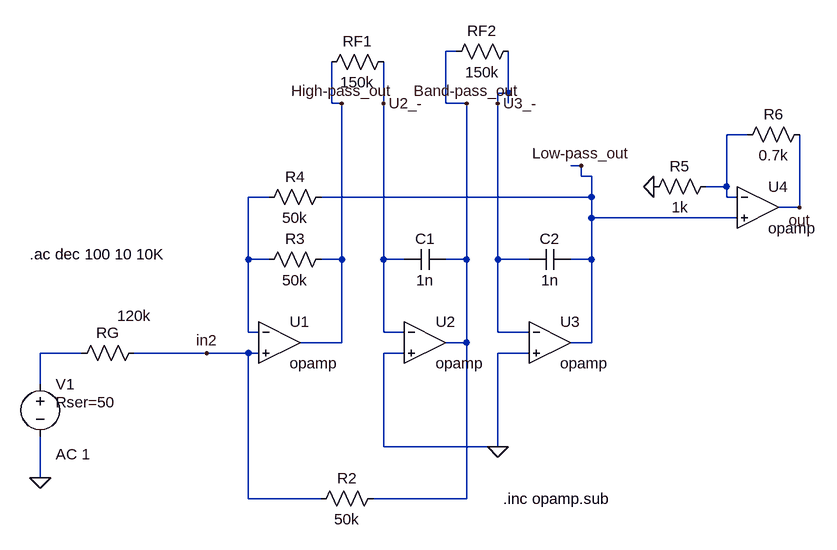
[diagram p0: schematic Desnormalizada.asc]
Desnormalizada.asc, the LTspice schematic file:
Version 4
SHEET 1 1836 1000
WIRE 896 -176 880 -176
WIRE 976 -112 976 -176
WIRE 976 -112 960 -112
WIRE 704 -96 704 -160
WIRE 720 -96 704 -96
WIRE 784 -96 784 -160
WIRE 880 -96 880 -176
WIRE 912 -96 880 -96
WIRE 960 -96 960 -112
WIRE 976 -96 976 -112
WIRE 1344 -48 1312 -48
WIRE 1088 0 1072 0
WIRE 1088 16 1088 0
WIRE 1104 16 1088 16
WIRE 1312 32 1312 -48
WIRE 1312 32 1280 32
WIRE 608 48 576 48
WIRE 1104 48 1104 16
WIRE 1104 48 688 48
WIRE 1312 48 1312 32
WIRE 1328 48 1312 48
WIRE 1424 64 1424 -48
WIRE 1424 64 1392 64
WIRE 1104 80 1104 48
WIRE 1328 80 1104 80
WIRE 576 144 576 48
WIRE 608 144 576 144
WIRE 720 144 720 -96
WIRE 720 144 688 144
WIRE 784 144 784 -96
WIRE 816 144 784 144
WIRE 912 144 912 -96
WIRE 912 144 880 144
WIRE 960 144 960 -96
WIRE 1008 144 960 144
WIRE 1104 144 1104 80
WIRE 1104 144 1072 144
WIRE 576 256 576 144
WIRE 592 256 576 256
WIRE 784 256 784 144
WIRE 816 256 784 256
WIRE 960 256 960 144
WIRE 1008 256 960 256
WIRE 720 272 720 144
WIRE 720 272 656 272
WIRE 912 272 912 144
WIRE 912 272 880 272
WIRE 1104 272 1104 144
WIRE 1104 272 1072 272
WIRE 320 288 256 288
WIRE 512 288 400 288
WIRE 576 288 512 288
WIRE 592 288 576 288
WIRE 816 288 784 288
WIRE 1008 288 960 288
WIRE 256 336 256 288
WIRE 784 432 784 288
WIRE 960 432 960 288
WIRE 960 432 784 432
WIRE 256 480 256 416
WIRE 576 512 576 288
WIRE 688 512 576 512
WIRE 912 512 912 272
WIRE 912 512 768 512
FLAG 512 288 in2
FLAG 960 432 0
FLAG 1088 0 Low-pass_out
FLAG 912 -96 Band-pass_out
FLAG 720 -96 High-pass_out
FLAG 784 -96 U2_-
FLAG 960 -96 U3_-
FLAG 256 480 0
FLAG 1200 32 0
FLAG 1424 64 out
SYMBOL voltage 256 320 R0
WINDOW 123 24 124 Left 2
WINDOW 39 24 44 Left 2
SYMATTR Value2 AC 1
SYMATTR SpiceLine Rser=50
SYMATTR InstName V1
SYMATTR Value ""
SYMBOL res 304 304 R270
WINDOW 0 32 56 VTop 2
WINDOW 3 89 97 VBottom 2
SYMATTR InstName RG
SYMATTR Value 120k
SYMBOL res 672 528 R270
WINDOW 0 32 56 VTop 2
WINDOW 3 0 56 VBottom 2
SYMATTR InstName R2
SYMATTR Value 50k
SYMBOL res 592 160 R270
WINDOW 0 32 56 VTop 2
WINDOW 3 0 56 VBottom 2
SYMATTR InstName R3
SYMATTR Value 50k
SYMBOL res 592 64 R270
WINDOW 0 32 56 VTop 2
WINDOW 3 0 56 VBottom 2
SYMATTR InstName R4
SYMATTR Value 50k
SYMBOL cap 816 160 R270
WINDOW 0 32 32 VTop 2
WINDOW 3 0 32 VBottom 2
SYMATTR InstName C1
SYMATTR Value 1n
SYMBOL cap 1008 160 R270
WINDOW 0 32 32 VTop 2
WINDOW 3 0 32 VBottom 2
SYMATTR InstName C2
SYMATTR Value 1n
SYMBOL res 688 -144 R270
WINDOW 0 32 56 VTop 2
WINDOW 3 0 56 VBottom 2
SYMATTR InstName RF1
SYMATTR Value 150k
SYMBOL res 880 -160 R270
WINDOW 0 32 56 VTop 2
WINDOW 3 0 56 VBottom 2
SYMATTR InstName RF2
SYMATTR Value 150k
SYMBOL OpAmps\\opamp 624 208 R0
SYMATTR InstName U1
SYMATTR SpiceLine2 GBW=10000000Meg
SYMBOL OpAmps\\opamp 848 208 R0
SYMATTR InstName U2
SYMATTR SpiceLine2 GBW=10000000Meg
SYMBOL OpAmps\\opamp 1040 208 R0
SYMATTR InstName U3
SYMATTR SpiceLine2 GBW=10000000Meg
SYMBOL OpAmps\\opamp 1360 0 R0
SYMATTR InstName U4
SYMATTR SpiceLine2 GBW=10000000Meg
SYMBOL res 1296 16 R90
WINDOW 0 0 56 VBottom 2
WINDOW 3 32 56 VTop 2
SYMATTR InstName R5
SYMATTR Value 1k
SYMBOL res 1440 -64 R90
WINDOW 0 0 56 VBottom 2
WINDOW 3 32 56 VTop 2
SYMATTR InstName R6
SYMATTR Value 0.7k
TEXT 968 512 Left 2 !.inc opamp.sub
TEXT 240 136 Left 2 !.ac dec 100 10 10K

The netlist it stands for:
* Desnormalizada.asc
V1 N003 0 AC 1 Rser=50
RG N003 in2 120k
R2 in2 Band-pass_out 50k
R3 N002 High-pass_out 50k
R4 N002 Low-pass_out 50k
C1 U2_- Band-pass_out 1n
C2 U3_- Low-pass_out 1n
RF1 High-pass_out U2_- 150k
RF2 Band-pass_out U3_- 150k
XU1 N002 in2 High-pass_out opamp Aol=100K GBW=10000000Meg  ; pins invin noninvin out
XU2 U2_- 0 Band-pass_out opamp Aol=100K GBW=10000000Meg  ; pins invin noninvin out
XU3 U3_- 0 Low-pass_out opamp Aol=100K GBW=10000000Meg  ; pins invin noninvin out
XU4 N001 Low-pass_out out opamp Aol=100K GBW=10000000Meg  ; pins invin noninvin out
R5 N001 0 1k
R6 out N001 0.7k
.inc opamp.sub
.ac dec 100 10 10K
.backanno
.end

* Results of the author's LTspice run, read from the files saved beside the schematic
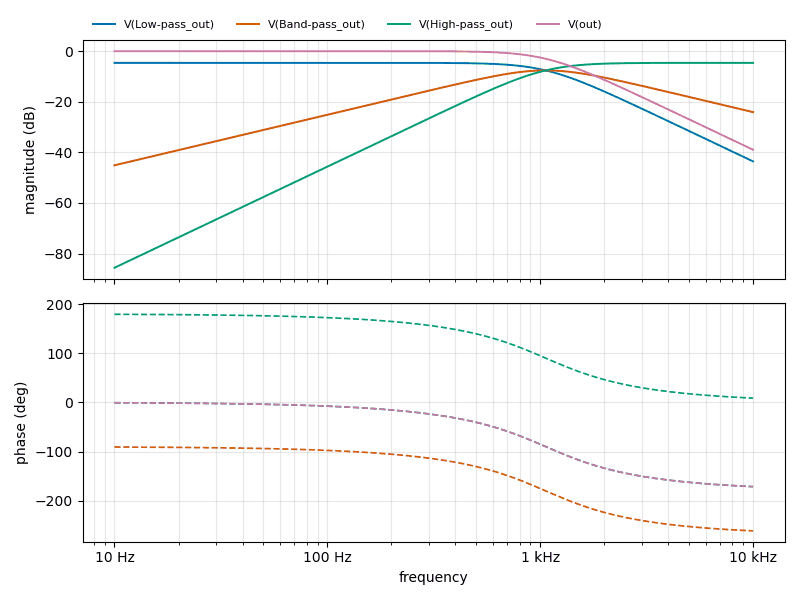
[diagram p1: AC Analysis of Desnormalizada.asc, plotted from the saved traces]
* AC Analysis, 1 run:
*   V(Low-pass_out): -4.61 dB at 10 Hz, -43.58 dB at 10 kHz, peak -4.61 dB at 60.26 Hz, 3 dB below the peak at 1.063 kHz
*   V(Band-pass_out): -45.13 dB at 10 Hz, -24.10 dB at 10 kHz, peak -7.61 dB at 1.072 kHz, 3 dB below the peak at 549.7 Hz and 2.048 kHz
*   V(High-pass_out): -85.64 dB at 10 Hz, -4.61 dB at 10 kHz, peak -4.61 dB at 10 kHz, 3 dB below the peak at 1.059 kHz
*   V(out): -0.00 dB at 10 Hz, -38.97 dB at 10 kHz, peak -0.00 dB at 60.26 Hz, 3 dB below the peak at 1.063 kHz